# Altium schematic sheet SL2.1A C192893.schdoc
size 127 x 99 mm
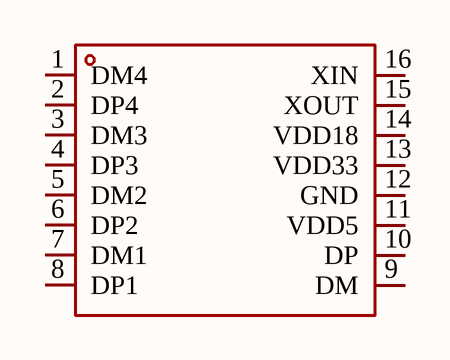
[diagram p0: SL2.1A C192893.schdoc]

## Parts
U?  SL2.1A  [SOP-16_L10.0-W3.9-P1.27-LS6.0-BL]  (value not drawn)

## Nets

Not connected (* = marked no-connect by the designer): U? 1(DM4) 2(DP4) 3(DM3) 4(DP3) 5(DM2) 6(DP2) 7(DM1) 8(DP1) 9(DM) 10(DP) 11(VDD5) 12(GND) 13(VDD33) 14(VDD18) 15(XOUT) 16(XIN)

## Library data of the parts
U? = SL2.1A: Manufacturer: CoreChips(和芯润德); Add into BOM: yes; Symbol: SL2.1A; Device: SL2.1A; LCSC Part Name: USB2.0高速4端口HUB控制器; Supplier Part: C192893; Manufacturer Part: SL2.1A; Supplier Footprint: SOP-16; JLCPCB Part Class: Extended Part; Datasheet: https://atta.szlcsc.com/upload/public/pdf/source/20180522/C192893_624110D24898D57AAC785E3DF98EA862.pdf; Supplier: LCSC; Convert to PCB: yes